# EAGLE schematic design-1 (EAGLE 9.4.2)
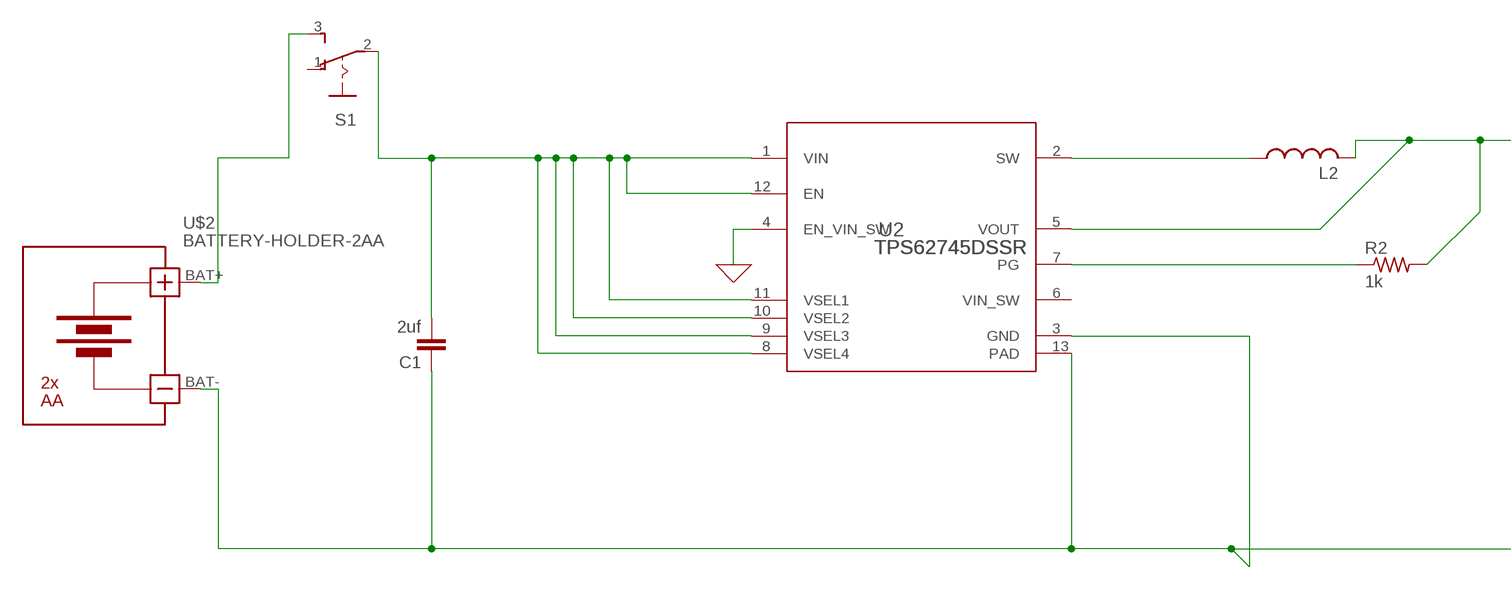
[diagram p0: schematic, sheet 1, part 1 of 2]
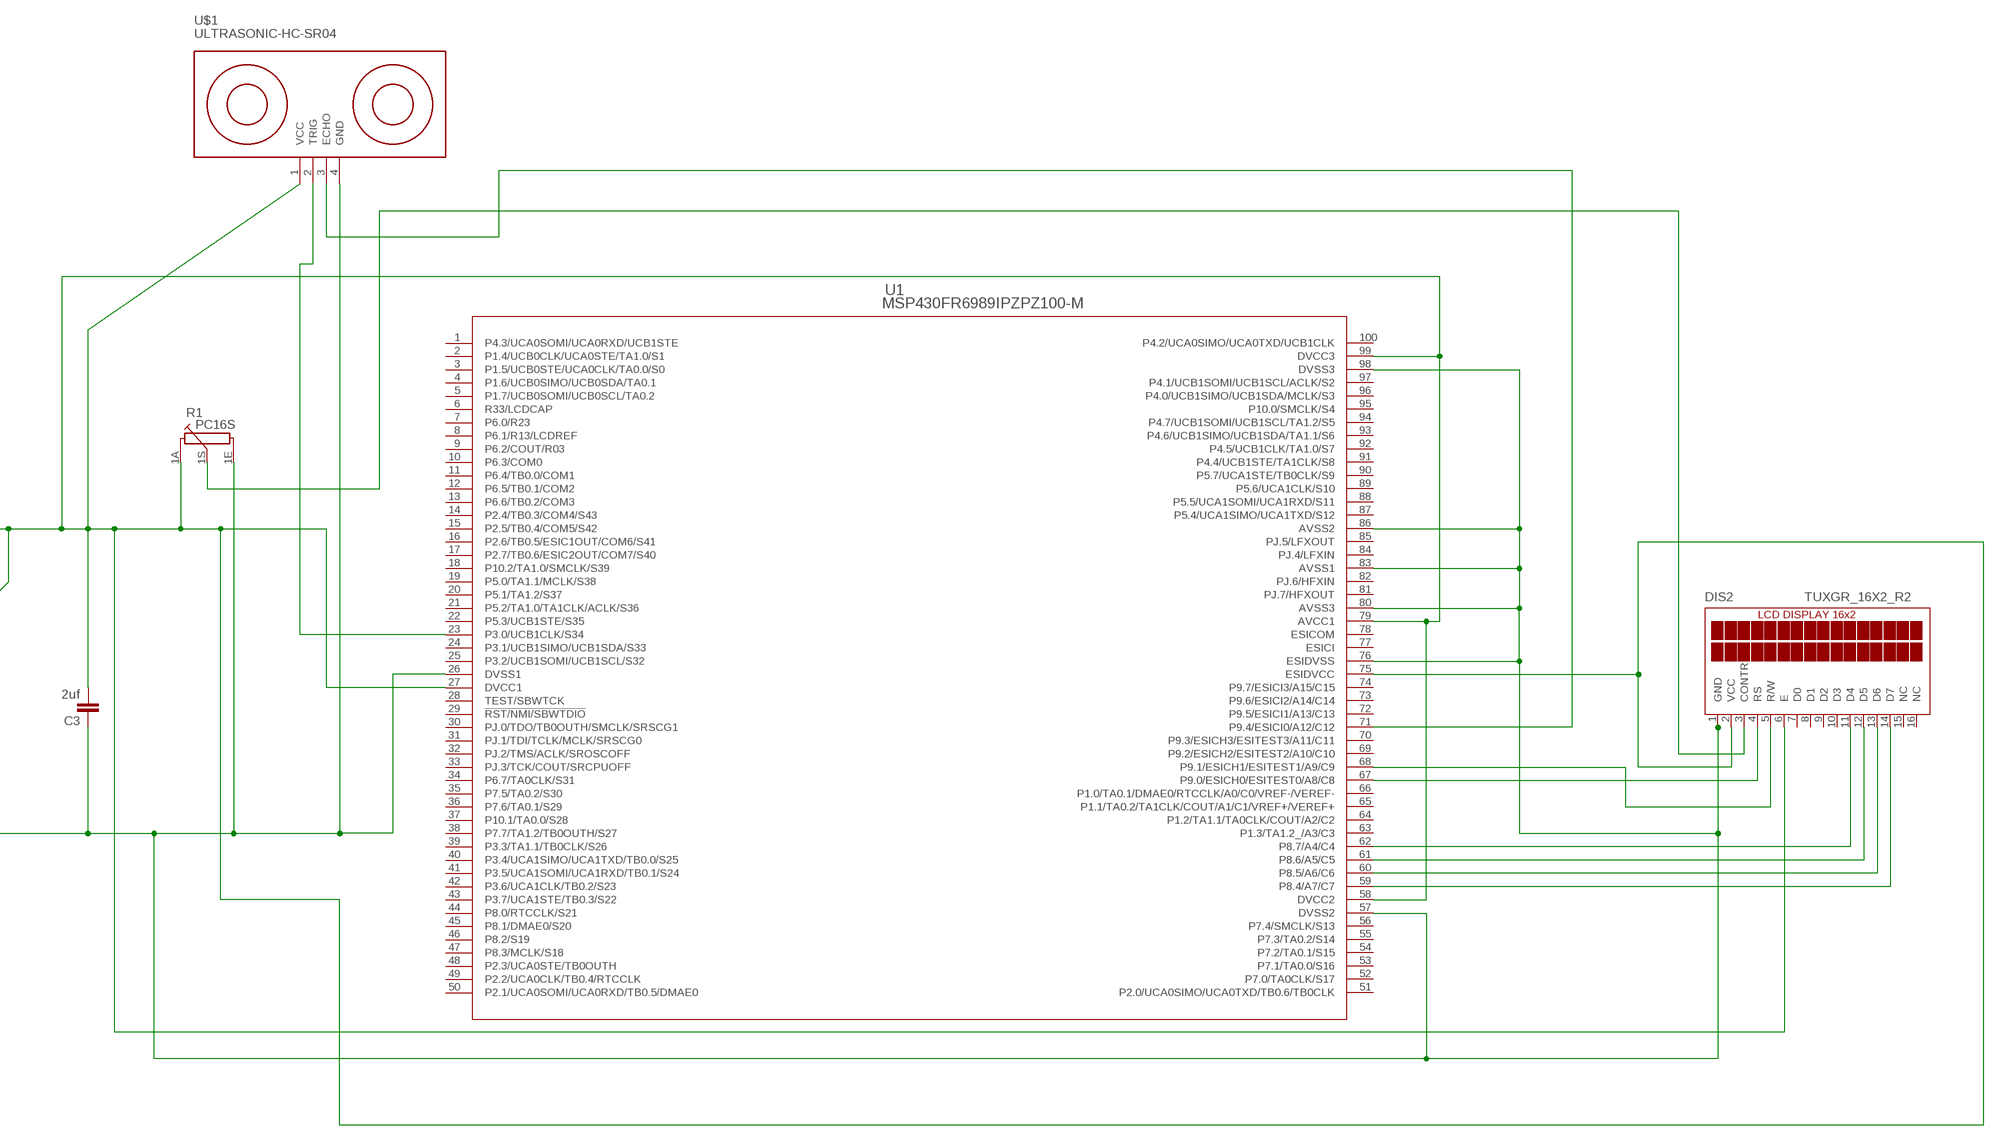
[diagram p1: schematic, sheet 1, part 2 of 2]

## Parts
C1  2uf  C-EUC0603  [C0603]
C3  2uf  C-EUC0603  [C0603]
DIS2  TUXGR_16X2_R2  [TUXGR_16X2_R2]
L2  L-US0204/5  [0204/5]
R1  PC16S  [PC16S]
R2  1k  R-US_R0603  [R0603]
S1  255SB  [255SB]
U1  MSP430FR6989IPZPZ100-M  [PZ100-M]
U2  TPS62745DSSR  [DSS0012A]
U$1  ULTRASONIC-HC-SR04  [ULTRASONIC-HC-SR04]
U$2  BATTERY-HOLDER-2AA  [BATTERY-HOLDER-2AA]

## Nets
0: U2.4(EN_VIN_SW) ; supply symbol labelled GND
N$1: C1.2 S1.2(P) U2.1(VIN) U2.8(VSEL4) U2.9(VSEL3) U2.10(VSEL2) U2.11(VSEL1) U2.12(EN)
N$2: C3.2 DIS2.2(VCC) DIS2.6(E) L2.2 R1.1A R2.2 U1.27(DVCC1) U1.58(DVCC2) U1.75(ESIDVCC) U1.79(AVCC1) U1.99(DVCC3) U2.5(VOUT) U$1.1(VCC)
N$3: R2.1 U2.7(PG)
N$4: S1.3(S) U$2.BAT+
N$5: DIS2.14(D7) U1.59(P8.4/A7/C7)
N$6: L2.1 U2.2(SW)
N$7: U1.71(P9.4/ESICI0/A12/C12) U$1.3(ECHO)
N$8: U1.23(P3.0/UCB1CLK/S34) U$1.2(TRIG)
N$9: DIS2.13(D6) U1.60(P8.5/A6/C6)
N$10: DIS2.12(D5) U1.61(P8.6/A5/C5)
N$11: DIS2.11(D4) U1.62(P8.7/A4/C4)
N$12: C1.1 C3.1 DIS2.1(GND) R1.1E U1.26(DVSS1) U1.57(DVSS2) U1.76(ESIDVSS) U1.80(AVSS3) U1.83(AVSS1) U1.86(AVSS2) U1.98(DVSS3) U2.3(GND) U2.13(PAD) U$1.4(GND) U$2.BAT-
N$13: DIS2.4(RS) U1.67(P9.0/ESICH0/ESITEST0/A8/C8)
N$14: DIS2.5(R/W) U1.68(P9.1/ESICH1/ESITEST1/A9/C9)
N$16: DIS2.3(CONTR) R1.1S
Unconnected: DIS2.7(D0) DIS2.8(D1) DIS2.9(D2) DIS2.10(D3) DIS2.15(NC) DIS2.16(NC) S1.1(O) U1.1(P4.3/UCA0SOMI/UCA0RXD/UCB1STE) U1.2(P1.4/UCB0CLK/UCA0STE/TA1.0/S1) U1.3(P1.5/UCB0STE/UCA0CLK/TA0.0/S0) U1.4(P1.6/UCB0SIMO/UCB0SDA/TA0.1) U1.5(P1.7/UCB0SOMI/UCB0SCL/TA0.2) U1.6(R33/LCDCAP) U1.7(P6.0/R23) U1.8(P6.1/R13/LCDREF) U1.9(P6.2/COUT/R03) U1.10(P6.3/COM0) U1.11(P6.4/TB0.0/COM1) U1.12(P6.5/TB0.1/COM2) U1.13(P6.6/TB0.2/COM3) U1.14(P2.4/TB0.3/COM4/S43) U1.15(P2.5/TB0.4/COM5/S42) U1.16(P2.6/TB0.5/ESIC1OUT/COM6/S41) U1.17(P2.7/TB0.6/ESIC2OUT/COM7/S40) U1.18(P10.2/TA1.0/SMCLK/S39) U1.19(P5.0/TA1.1/MCLK/S38) U1.20(P5.1/TA1.2/S37) U1.21(P5.2/TA1.0/TA1CLK/ACLK/S36) U1.22(P5.3/UCB1STE/S35) U1.24(P3.1/UCB1SIMO/UCB1SDA/S33) U1.25(P3.2/UCB1SOMI/UCB1SCL/S32) U1.28(TEST/SBWTCK) U1.29(!RST/NMI/SBWTDIO) U1.30(PJ.0/TDO/TB0OUTH/SMCLK/SRSCG1) U1.31(PJ.1/TDI/TCLK/MCLK/SRSCG0) U1.32(PJ.2/TMS/ACLK/SROSCOFF) U1.33(PJ.3/TCK/COUT/SRCPUOFF) U1.34(P6.7/TA0CLK/S31) U1.35(P7.5/TA0.2/S30) U1.36(P7.6/TA0.1/S29) U1.37(P10.1/TA0.0/S28) U1.38(P7.7/TA1.2/TB0OUTH/S27) U1.39(P3.3/TA1.1/TB0CLK/S26) U1.40(P3.4/UCA1SIMO/UCA1TXD/TB0.0/S25) U1.41(P3.5/UCA1SOMI/UCA1RXD/TB0.1/S24) U1.42(P3.6/UCA1CLK/TB0.2/S23) U1.43(P3.7/UCA1STE/TB0.3/S22) U1.44(P8.0/RTCCLK/S21) U1.45(P8.1/DMAE0/S20) U1.46(P8.2/S19) U1.47(P8.3/MCLK/S18) U1.48(P2.3/UCA0STE/TB0OUTH) U1.49(P2.2/UCA0CLK/TB0.4/RTCCLK) U1.50(P2.1/UCA0SOMI/UCA0RXD/TB0.5/DMAE0) U1.51(P2.0/UCA0SIMO/UCA0TXD/TB0.6/TB0CLK) U1.52(P7.0/TA0CLK/S17) U1.53(P7.1/TA0.0/S16) U1.54(P7.2/TA0.1/S15) U1.55(P7.3/TA0.2/S14) U1.56(P7.4/SMCLK/S13) U1.63(P1.3/TA1.2_/A3/C3) U1.64(P1.2/TA1.1/TA0CLK/COUT/A2/C2) U1.65(P1.1/TA0.2/TA1CLK/COUT/A1/C1/VREF+/VEREF+) U1.66(P1.0/TA0.1/DMAE0/RTCCLK/A0/C0/VREF-/VEREF-) U1.69(P9.2/ESICH2/ESITEST2/A10/C10) U1.70(P9.3/ESICH3/ESITEST3/A11/C11) U1.72(P9.5/ESICI1/A13/C13) U1.73(P9.6/ESICI2/A14/C14) U1.74(P9.7/ESICI3/A15/C15) U1.77(ESICI) U1.78(ESICOM) U1.81(PJ.7/HFXOUT) U1.82(PJ.6/HFXIN) U1.84(PJ.4/LFXIN) U1.85(PJ.5/LFXOUT) U1.87(P5.4/UCA1SIMO/UCA1TXD/S12) U1.88(P5.5/UCA1SOMI/UCA1RXD/S11) U1.89(P5.6/UCA1CLK/S10) U1.90(P5.7/UCA1STE/TB0CLK/S9) U1.91(P4.4/UCB1STE/TA1CLK/S8) U1.92(P4.5/UCB1CLK/TA1.0/S7) U1.93(P4.6/UCB1SIMO/UCB1SDA/TA1.1/S6) U1.94(P4.7/UCB1SOMI/UCB1SCL/TA1.2/S5) U1.95(P10.0/SMCLK/S4) U1.96(P4.0/UCB1SIMO/UCB1SDA/MCLK/S3) U1.97(P4.1/UCB1SOMI/UCB1SCL/ACLK/S2) U1.100(P4.2/UCA0SIMO/UCA0TXD/UCB1CLK)

## Power pins joined to a net without a drawn wire
VIN_SW: U2.6(VIN_SW)

## Library data of the parts
C1 C3 = rcl:C-EU: CAPACITOR, European symbol; SPICEPREFIX: C
DIS2 = display-lcd:TUXGR_16X2_R2: Tuxgraphics LCD display 16x2 characters reflective, without background light Source: tuxgr_12x2_r2.pdf; OC_FARNELL: unknown; OC_NEWARK: unknown
L2 = rcl:L-US: INDUCTOR, American symbol; SPICEPREFIX: L
R1 = piher:PC16S: POTENTIOMETER single carbon potentiometer, 16 mm, S3ROH; OC_FARNELL: 4452940; OC_NEWARK: unknown
R2 = rcl:R-US_: RESISTOR, American symbol; SPICEPREFIX: R
S1 = switch:255SB: SLIDING SWITCH Distributor Buerklin, 11G810
U1 = msp:MSP430FR6989IPZ; MANUFACTURER_PART_NUMBER: MSP430FR6989IPZ; VENDOR: Texas Instruments
U2 = untitled:TPS62745DSSR
U$1 = diy-modules:ULTRASONIC-HC-SR04: Ultrasonic Ranging Module HC-SR04 More details available here: http://randomnerdtutorials.com/complete-guide-for-ultrasonic-sensor-hc-sr04/ Click here to find device on ebay.com <http://www.ebay.com/sch/hc+sr04+ultrasonic>
U$2 = diy-modules:BATTERY-HOLDER-2AA: Battery Holder 2 x AA Click here to find device on ebay.com <http://www.ebay.com/sch/battery+plastic+holder+aa+2x1.5v>